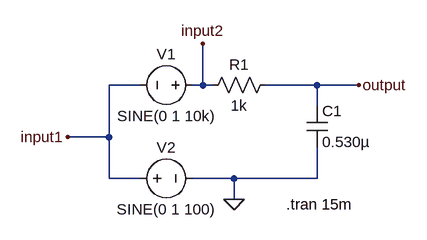
[diagram p0: schematic low-pass-analysis.asc]
low-pass-analysis.asc, the LTspice schematic file:
Version 4
SHEET 1 880 680
WIRE 32 96 -16 96
WIRE 128 96 128 32
WIRE 128 96 112 96
WIRE 144 96 128 96
WIRE 304 96 224 96
WIRE 368 96 304 96
WIRE 304 128 304 96
WIRE -16 176 -16 96
WIRE -16 176 -80 176
WIRE -16 240 -16 176
WIRE 32 240 -16 240
WIRE 176 240 112 240
WIRE 304 240 304 192
WIRE 304 240 176 240
WIRE 176 272 176 240
FLAG 176 272 0
FLAG 368 96 output
FLAG -80 176 input1
FLAG 128 32 input2
SYMBOL res 240 80 R90
WINDOW 0 0 56 VBottom 2
WINDOW 3 32 56 VTop 2
SYMATTR InstName R1
SYMATTR Value 1k
SYMBOL cap 288 128 R0
SYMATTR InstName C1
SYMATTR Value 0.530µ
SYMBOL voltage 128 96 R90
WINDOW 0 -32 56 VBottom 2
WINDOW 3 32 56 VTop 2
WINDOW 123 0 0 Left 0
WINDOW 39 0 0 Left 0
SYMATTR InstName V1
SYMATTR Value SINE(0 1 10k)
SYMBOL voltage 16 240 R270
WINDOW 0 32 56 VTop 2
WINDOW 3 -32 56 VBottom 2
WINDOW 123 0 0 Left 0
WINDOW 39 0 0 Left 0
SYMATTR InstName V2
SYMATTR Value SINE(0 1 100)
TEXT 256 280 Left 2 !.tran 15m

The netlist it stands for:
* low-pass-analysis.asc
R1 output input2 1k
C1 output 0 0.530µ
V1 input2 input1 SINE(0 1 10k)
V2 input1 0 SINE(0 1 100)
.tran 15m
.backanno
.end

* Results of the author's LTspice run, read from the files saved beside the schematic
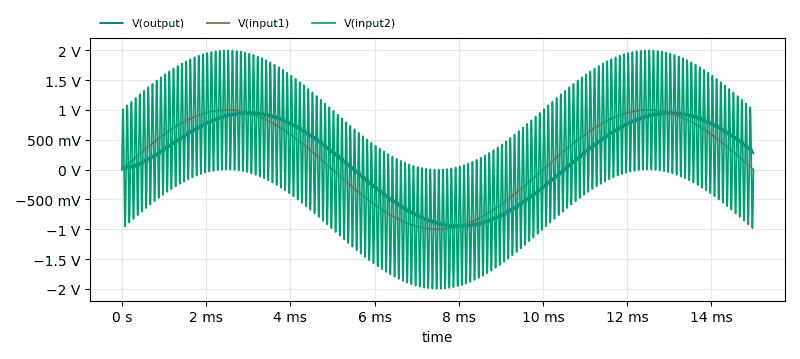
[diagram p1: Transient Analysis of low-pass-analysis.asc, plotted from the saved traces]
* Transient Analysis, 1 run:
*   V(output): min -975.7 mV, max 976.5 mV, average 202.7 mV, rms 672.6 mV, last 270 mV
*   V(input1): min -1 V, max 1 V, average 212.2 mV, rms 707.1 mV, last 0 V
*   V(input2): min -1.999 V, max 1.999 V, average 212.2 mV, rms 1.008 V, last 0 V